# Altium schematic sheet BluetoothConnectivity.SchDoc
size 381 x 241 mm
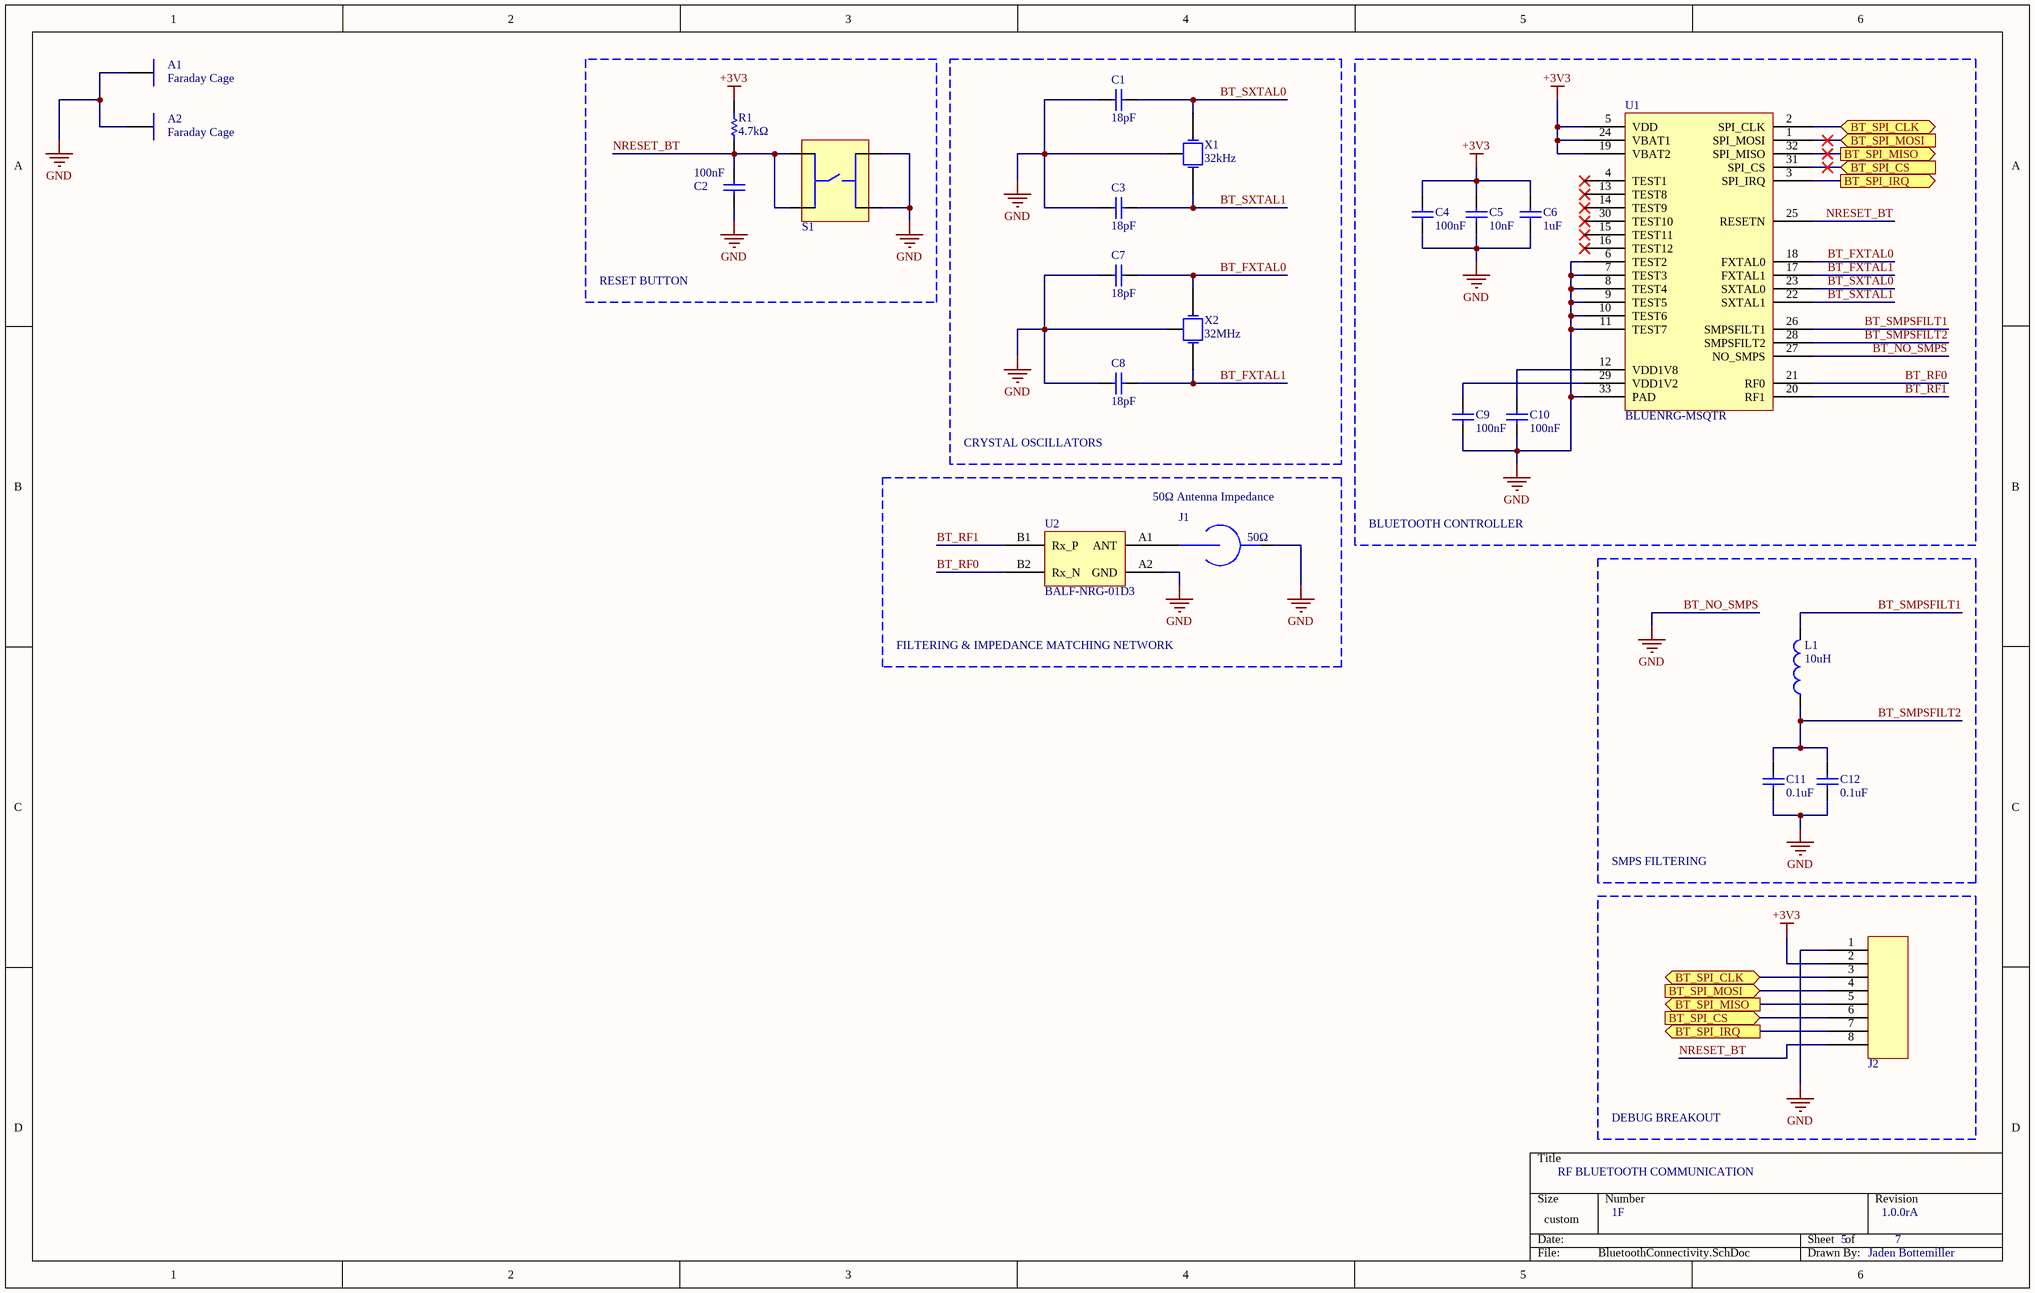
[diagram p0: BluetoothConnectivity.SchDoc]

## Parts
A1  Faraday Cage
A2  Faraday Cage
C1  value 18pF  (hidden comment: CAP)
C2  value 100nF  (hidden comment: CAP)
C3  value 18pF  (hidden comment: CAP)
C4  value 100nF  (hidden comment: CAP)
C5  value 10nF  (hidden comment: CAP)
C6  value 1uF  (hidden comment: CAP)
C7  value 18pF  (hidden comment: CAP)
C8  value 18pF  (hidden comment: CAP)
C9  value 100nF  (hidden comment: CAP)
C10  value 100nF  (hidden comment: CAP)
C11  value 0.1uF  (hidden comment: CAP)
C12  value 0.1uF  (hidden comment: CAP)
J1  Impedance: 50Ω  (hidden comment: Coaxial Connection)
J2  8 Pin Connector  (value not drawn)
L1  value 10uH  (hidden comment: IND)
R1  value 4.7kΩ  (hidden comment: RES)
S1  Pushbutton  (value not drawn)
U1  BLUENRG-MSQTR
U2  BALF-NRG-01D3
X1  value 32kHz  (hidden comment: Crystal Oscillator)
X2  value 32MHz  (hidden comment: Crystal Oscillator)

## Blocks framed on the sheet
RESET BUTTON: C2 R1 S1
CRYSTAL OSCILLATORS: C1 C3 C7 C8 X1 X2
BLUETOOTH CONTROLLER: C4-C6 C9 C10 U1
SMPS FILTERING: C11 C12 L1
DEBUG BREAKOUT: J2

## Ports
BT_SPI_CLK (bidir), BT_SPI_CS (in), BT_SPI_IRQ (out), BT_SPI_MISO (out), BT_SPI_MOSI (in)

## Nets
+3V3: C4.2 C5.2 C6.2 J2.2(Pin) R1.2 U1.5(VDD) U1.19(VBAT2) U1.24(VBAT1)
BT_NO_SMPS: A1.1(Pin) A2.1(Pin) C1.2 C2.1 C3.2 C4.1 C5.1 C6.1 C7.2 C8.2 C9.1 C10.1 C11.1 C12.1 J1.2 J2.1(Pin) S1.3(Pin) S1.4(Pin) U1.6(TEST2) U1.7(TEST3) U1.8(TEST4) U1.9(TEST5) U1.10(TEST6) U1.11(TEST7) U1.27(NO_SMPS) U1.33(PAD) U2.A2(GND) X1.3(GND) X2.3(GND)  [also labelled GND]
BT_FXTAL0: C7.1 U1.18(FXTAL0) X2.1(X1)
BT_FXTAL1: C8.1 U1.17(FXTAL1) X2.2(X2)
BT_RF0: U1.21(RF0) U2.B2(Rx_N)
BT_RF1: U1.20(RF1) U2.B1(Rx_P)
BT_SMPSFILT1: L1.2 U1.26(SMPSFILT1)
BT_SMPSFILT2: C11.2 C12.2 L1.1 U1.28(SMPSFILT2)
BT_SPI_CLK: J2.3(Pin) U1.2(SPI_CLK) ; port BT_SPI_CLK
BT_SPI_CS: J2.6(Pin) U1.31(SPI_CS) ; port BT_SPI_CS
BT_SPI_IRQ: J2.7(Pin) U1.3(SPI_IRQ) ; port BT_SPI_IRQ
BT_SPI_MISO: J2.5(Pin) U1.32(SPI_MISO) ; port BT_SPI_MISO
BT_SPI_MOSI: J2.4(Pin) U1.1(SPI_MOSI) ; port BT_SPI_MOSI
BT_SXTAL0: C1.1 U1.23(SXTAL0) X1.1(X1)
BT_SXTAL1: C3.1 U1.22(SXTAL1) X1.2(X2)
NRESET_BT: C2.2 J2.8(Pin) R1.1 S1.1 S1.2(Pin) U1.25(RESETN)
NetC9_2: C9.2 U1.29(VDD1V2)
NetC10_2: C10.2 U1.12(VDD1V8)
NetJ1_1: J1.1(Pin) U2.A1(ANT)

Not connected (* = marked no-connect by the designer): U1 4(TEST1)* 13(TEST8)* 14(TEST9)* 15(TEST11)* 16(TEST12)* 30(TEST10)*

## Notes on the sheet
- 50Ω Antenna Impedance
- FILTERING & IMPEDANCE MATCHING NETWORK
- RF BLUETOOTH COMMUNICATION
- 1F
- 5
- 1.0.0rA
- 7
- Jaden Bottemiller

## Library data of the parts
A1 A2 = Faraday Cage: Standard Faraday Cage
C1-C12 = CAP: Standard Capacitor
J1 = COAX: Coaxial Connection, e.g. to antennae
J2 = CONN_8PIN: Standard 8 Pin Connector
L1 = IND: Standard Inductor
R1 = RES: Standard Resistor; Tolerance: 1%
S1 = PUSHBTN_4T: Standard Pushbutton with 4 Terminals
U1 = BLUENRG-MSQTR: IC RF TxRx + MCU Bluetooth Bluetooth v4.1 2.4GHz 32-VFQFN Exposed Pad; ComponentLink1Description: DigiKey; ComponentLink1URL: https://www.digikey.com/product-detail/en/stmicroelectronics/BLUENRG-MSQTR/497-15639-1-ND/5267982; ComponentLink2Description: Datasheet; ComponentLink2URL: https://www.st.com/content/ccc/resource/technical/document/datasheet/e8/76/3d/fb/28/e0/40/0b/DM00141263.pdf/files/DM00141263.pdf/jcr:content/translations/en.DM00141263.pdf; ComponentLink3Description: SPI Interface; ComponentLink3URL: https://www.st.com/content/ccc/resource/technical/document/user_manual/6d/a1/5b/6c/dc/ab/48/76/DM00162667.pdf/files/DM00162667.pdf/jcr:content/translations/en.DM00162667.pdf
U2 = BALF-NRG-01D3: RF Balun 2.4GHz ~ 2.5GHz 50 / 50Ohm 4-WFBGA, FCBGA
X1 X2 = OSC_1GND: Standard Crystal Oscillator with a ground connection.